# Altium schematic sheet p1_hardware_architecture.SchDoc
size A1; Organization: Protel International P/L; Address1: L3, 12a Rodborough Rd; Address2: Frenchs Forest; Address3: NSW; Address4: Australia 2086
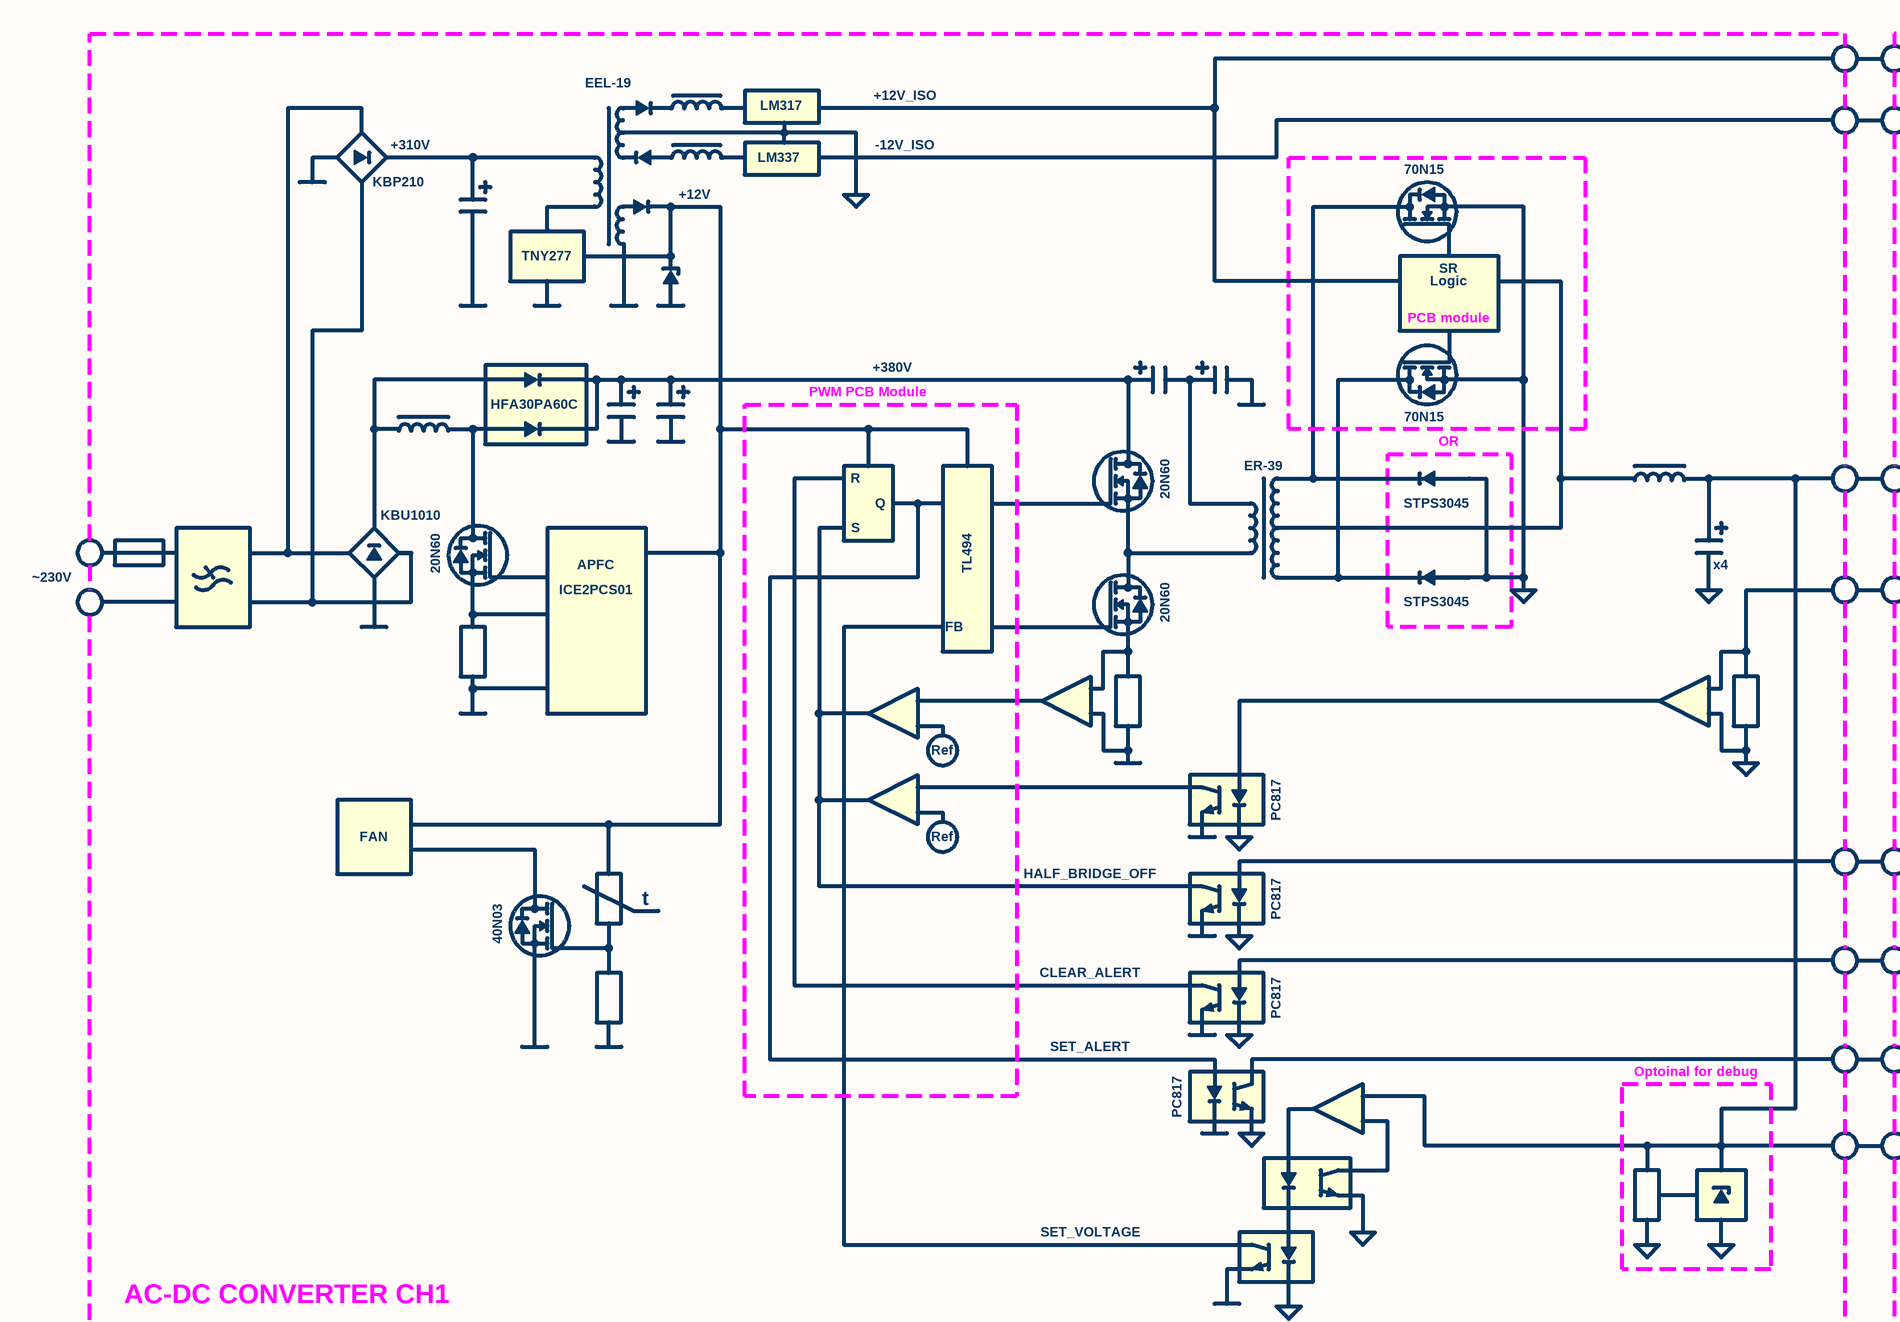
[diagram p0: p1_hardware_architecture.SchDoc, top left]
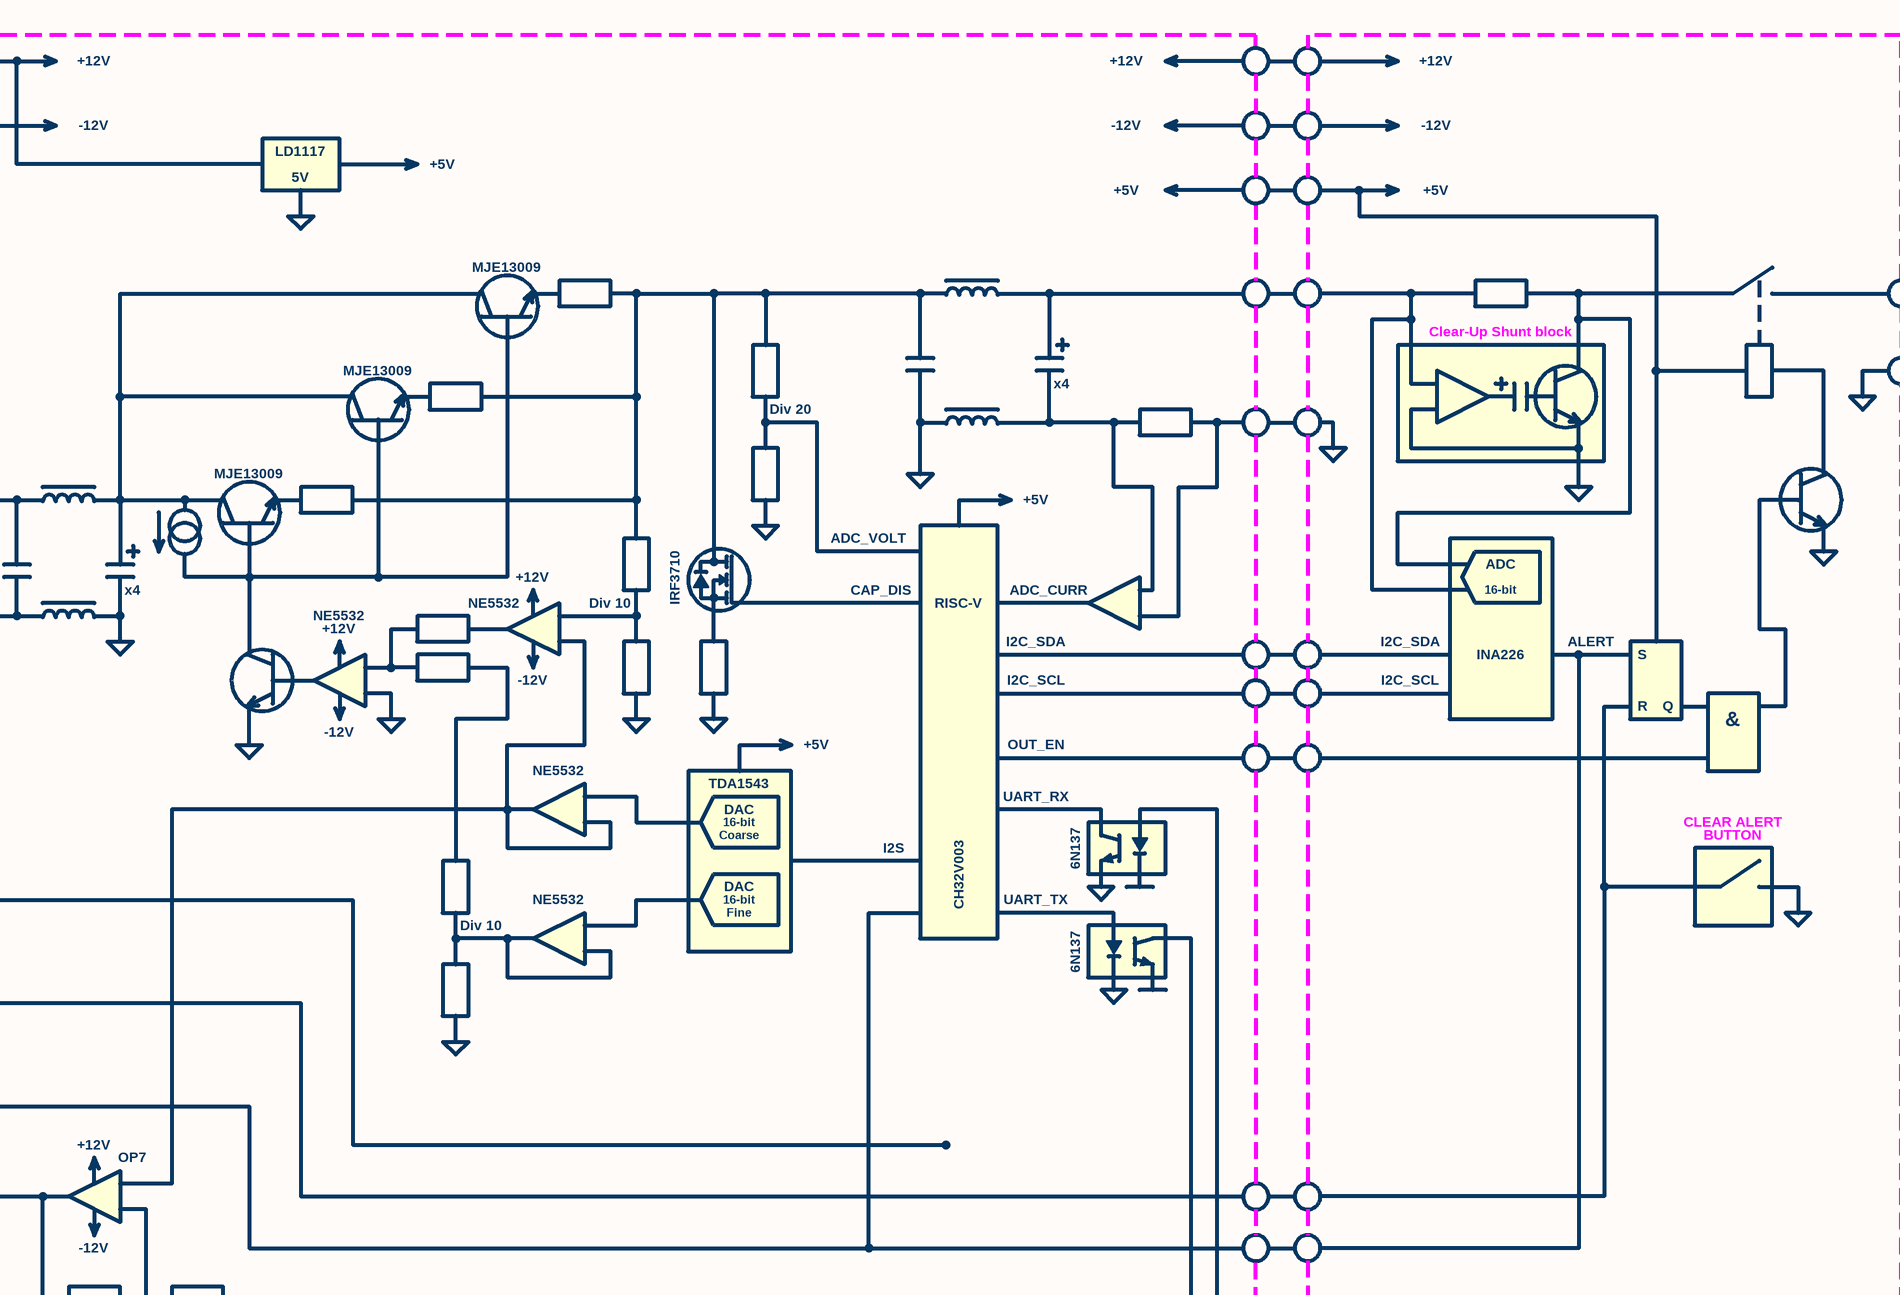
[diagram p1: p1_hardware_architecture.SchDoc, top right]
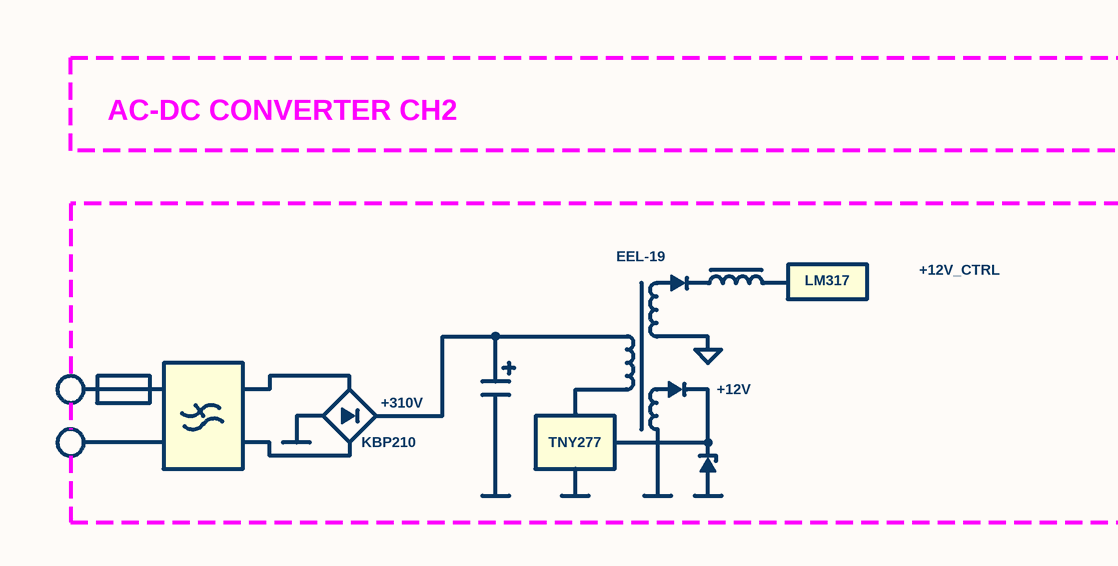
[diagram p2: p1_hardware_architecture.SchDoc, bottom left]
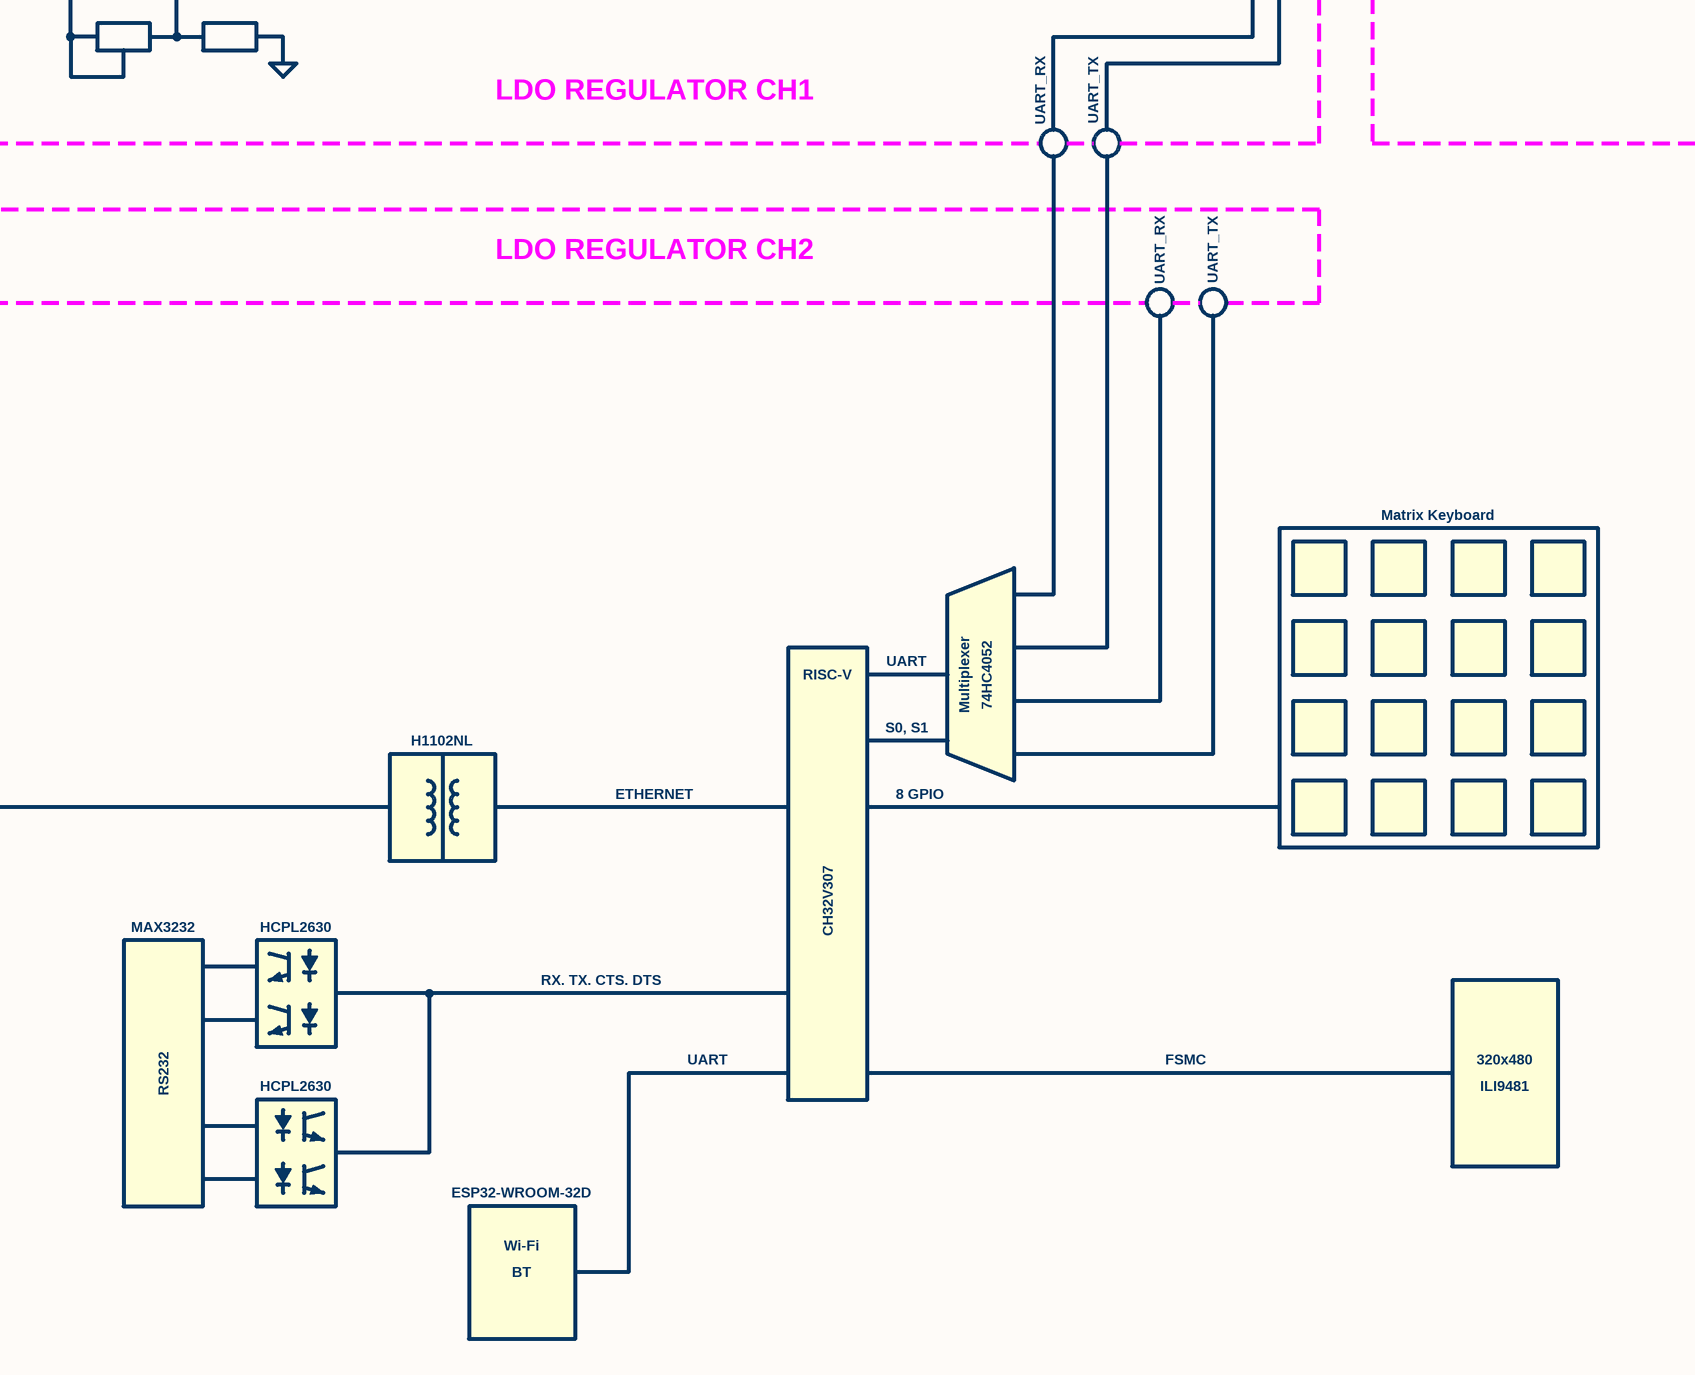
[diagram p3: p1_hardware_architecture.SchDoc, bottom right]

## Notes on the sheet
- EEL-19
- +12V_ISO
- +12V
- +310V
- LM337
- LM317
- -12V_ISO
- -12V
- LD1117
- +5V
- KBP210
- 70N15
- 5V
- TNY277
- SR
- Logic
- MJE13009
- PCB module
- Clear-Up Shunt block
- HFA30PA60C
- PWM PCB Module
- +380V
- Div 20
- x4
- ER-39
- OR
- KBU1010
- R
- S
- Q
- 20N60
- STPS3045
- ADC_VOLT
- ~230V
- APFC
- ICE2PCS01
- TL494
- NE5532
- Div 10
- IRF3710
- CAP_DIS
- RISC-V
- ADC_CURR
- ADC
- 16-bit
- FB
- I2C_SDA
- I2C_SCL
- INA226
- ALERT
- OUT_EN
- &
- Ref
- DAC
- TDA1543
- UART_RX
- CLEAR ALERT
- FAN
- PC817
- Coarse
- I2S
- CH32V003
- 6N137
- BUTTON
- t
- HALF_BRIDGE_OFF
- Fine
- UART_TX
- 40N03
- CLEAR_ALERT
- SET_ALERT
- Optoinal for debug
- OP7
- SET_VOLTAGE
- AC-DC CONVERTER CH1
- LDO REGULATOR CH1
- AC-DC CONVERTER CH2
- LDO REGULATOR CH2
- +12V_CTRL
- Matrix Keyboard
- UART
- Multiplexer
- 74HC4052
- H1102NL
- S0, S1
- ETHERNET
- 8 GPIO
- MAX3232
- HCPL2630
- CH32V307
- RX. TX. CTS. DTS
- RS232
- FSMC
- ILI9481
- 320x480
- ESP32-WROOM-32D
- Wi-Fi
- BT
- Title
- Size:
- Date:
- File:
- A2
- Number:
- Time:
- Revision:
- Sheet
- of